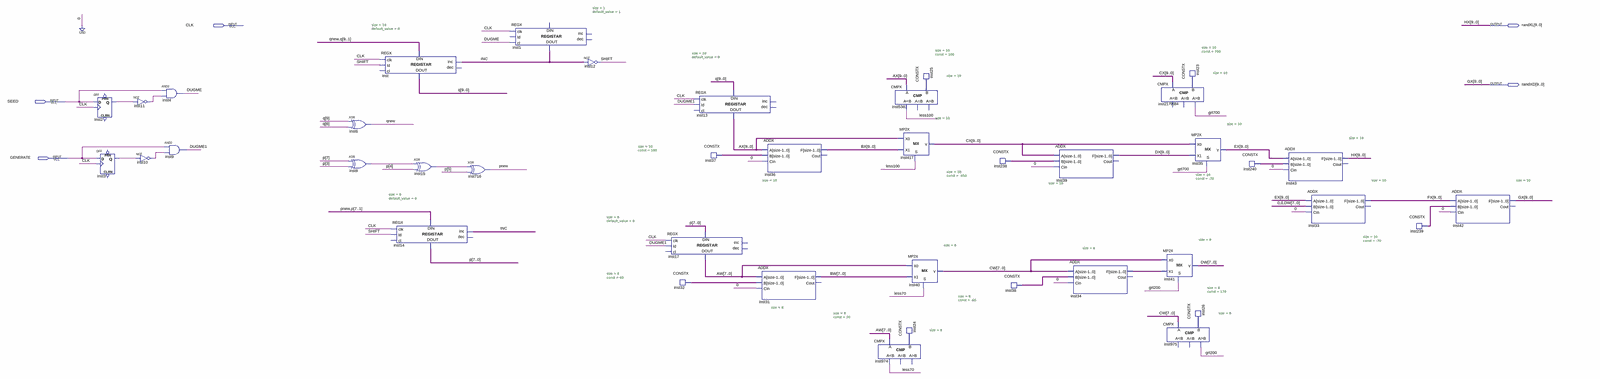
[diagram p0: schematic sheet, whole]
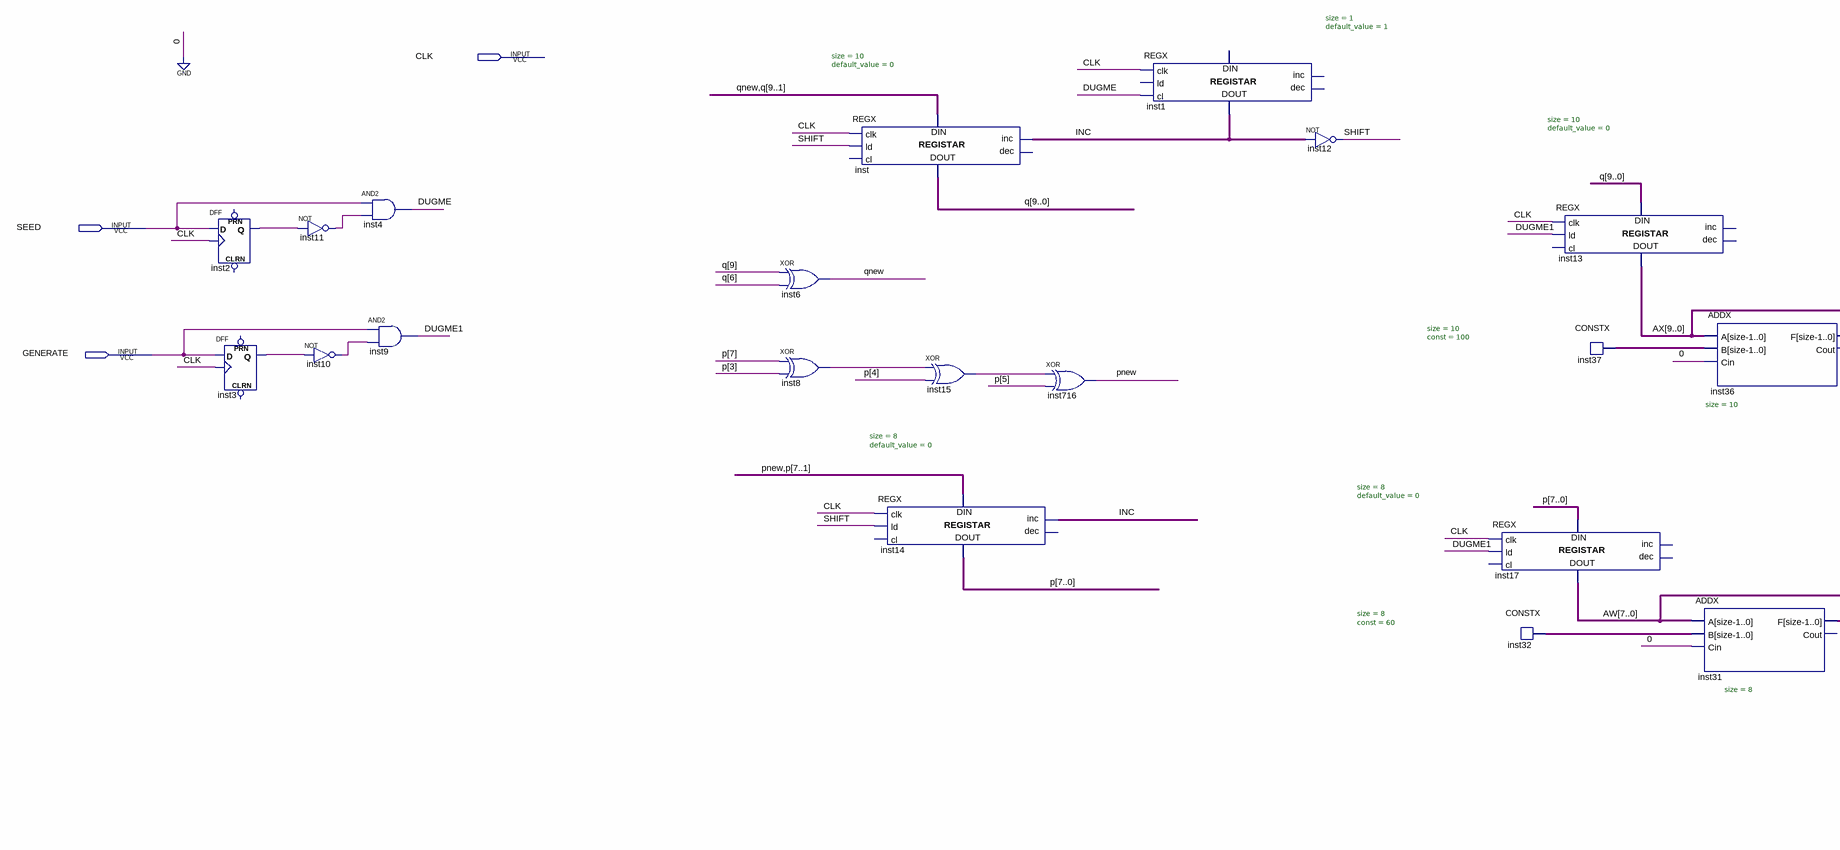
[diagram p1: schematic sheet, left part]
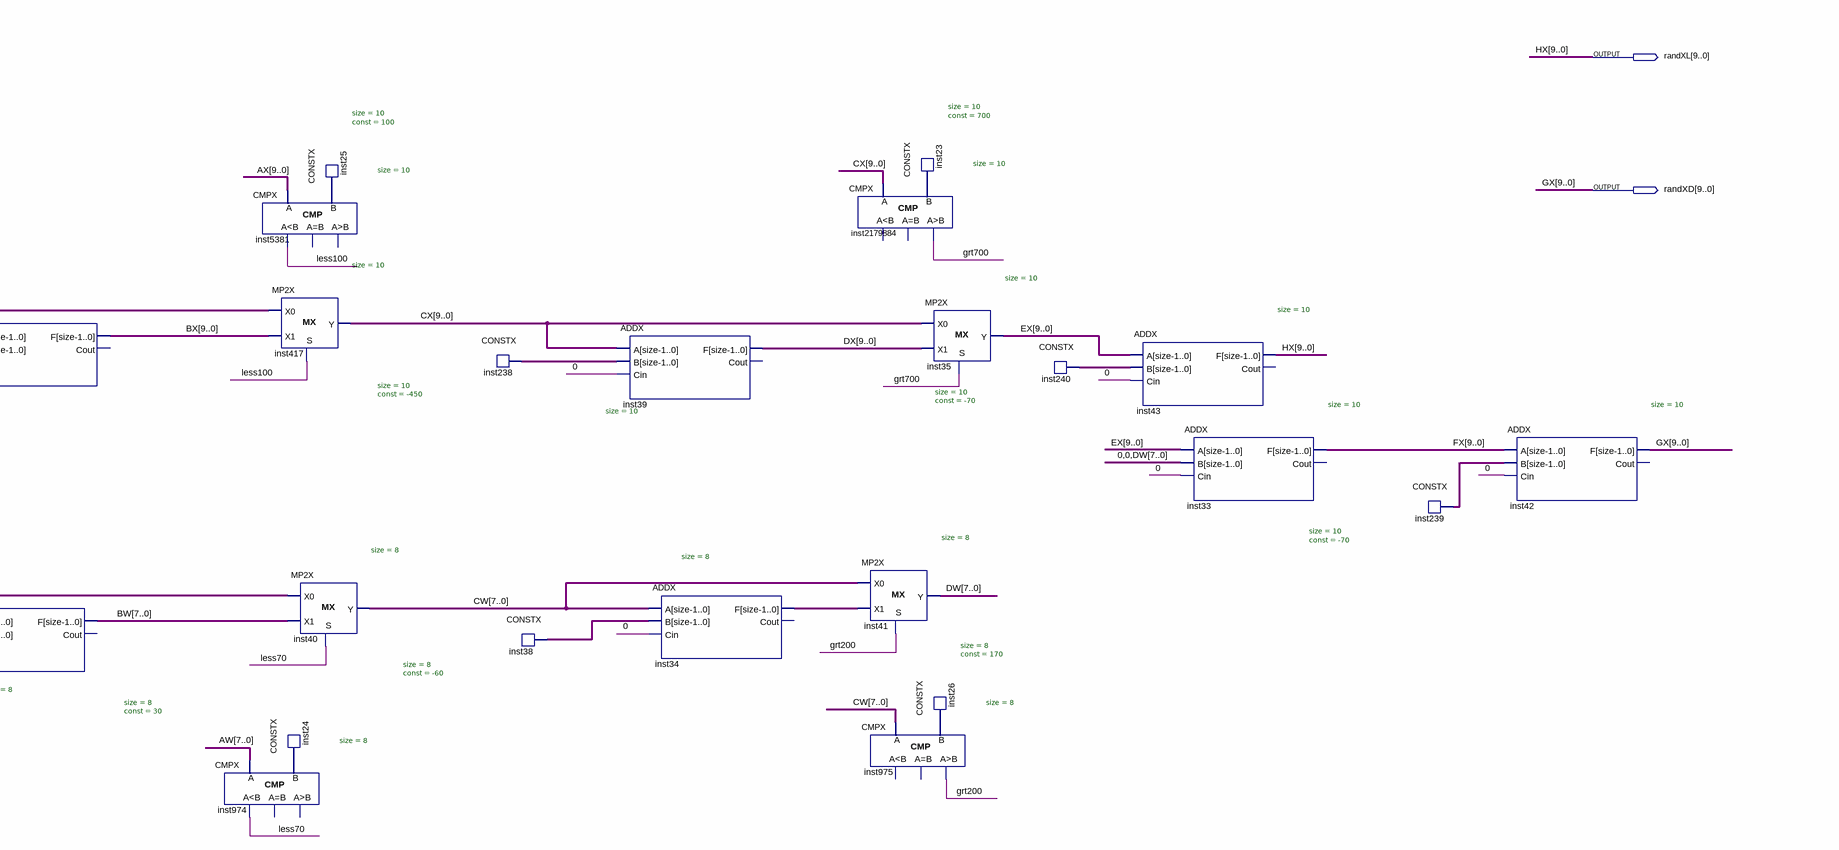
[diagram p2: schematic sheet, right part]
// Quartus schematic random.bdf as structural Verilog: 41 symbols, 5 pins
module random (
  input  CLK,
  input  SEED,
  input  GENERATE,
  output [9:0] randXL,
  output [9:0] randXD
);

  wire DUGME, DUGME1, grt200, grt700, INC, inst2_q, inst3_q, inst8_out, inst10_out, inst11_out, inst15_out,
       less70, less100, pnew, qnew, SHIFT;
  wire [7:0] AW, BW, CW, DW, inst24_data, inst26_data, inst32_data, inst34_f, inst38_data, p;
  wire [9:0] AX, BX, CX, DX, EX, FX, inst23_data, inst25_data, inst37_data, inst238_data, inst239_data,
       inst240_data, q;

  DFF inst2 (.CLK(CLK), .D(SEED), .Q(inst2_q));  // open: CLRN, PRN
  DFF inst3 (.CLK(CLK), .D(GENERATE), .Q(inst3_q));  // open: CLRN, PRN
  not inst11 (inst11_out, inst2_q);
  not inst10 (inst10_out, inst3_q);
  and inst4 (DUGME, SEED, inst11_out);
  and inst9 (DUGME1, GENERATE, inst10_out);
  xor inst6 (qnew, q[9], q[6]);
  xor inst8 (inst8_out, p[7], p[3]);
  REGX #(.size(10), .default_value(0)) inst (
    .clk(CLK), .ld(SHIFT), .inc(INC), .data_in({qnew, q[9:1]}), .data_out(q));  // open: cl, dec
  REGX #(.size(8), .default_value(0)) inst14 (
    .clk(CLK), .ld(SHIFT), .inc(INC), .data_in({pnew, p[7:1]}), .data_out(p));  // open: cl, dec
  xor inst15 (inst15_out, inst8_out, p[4]);
  xor inst716 (pnew, inst15_out, p[5]);
  REGX #(.size(1), .default_value(1)) inst1 (.clk(CLK), .cl(DUGME), .data_out(INC));  // open: ld, inc, dec, data_in
  not inst12 (SHIFT, INC);
  REGX #(.size(8), .default_value(0)) inst17 (
    .clk(CLK), .ld(DUGME1), .data_in(p), .data_out(AW));  // open: cl, inc, dec
  CONSTX #(.size(8), .\const (60)) inst32 (.data(inst32_data));
  REGX #(.size(10), .default_value(0)) inst13 (
    .clk(CLK), .ld(DUGME1), .data_in(q), .data_out(AX));  // open: cl, inc, dec
  CONSTX #(.size(10), .\const (100)) inst37 (.data(inst37_data));
  ADDX #(.size(8)) inst31 (.A(AW), .B(inst32_data), .Cin(1'b0), .F(BW));  // open: Cout
  ADDX #(.size(10)) inst36 (.A(AX), .B(inst37_data), .Cin(1'b0), .F(BX));  // open: Cout
  CMPX #(.size(8)) inst974 (.A(AW), .B(inst24_data), .ls(less70));  // open: eq, gr
  CMPX #(.size(10)) inst5381 (.A(AX), .B(inst25_data), .ls(less100));  // open: eq, gr
  CONSTX #(.size(10), .\const (100)) inst25 (.data(inst25_data));
  MP2X #(.size(10)) inst417 (.S(less100), .X0(AX), .X1(BX), .Y(CX));
  MP2X #(.size(8)) inst40 (.S(less70), .X0(AW), .X1(BW), .Y(CW));
  CONSTX #(.size(8), .\const (30)) inst24 (.data(inst24_data));
  CONSTX #(.size(10), .\const (-450)) inst238 (.data(inst238_data));
  CONSTX #(.size(8), .\const (-60)) inst38 (.data(inst38_data));
  ADDX #(.size(10)) inst39 (.A(CX), .B(inst238_data), .Cin(1'b0), .F(DX));  // open: Cout
  ADDX #(.size(8)) inst34 (.A(CW), .B(inst38_data), .Cin(1'b0), .F(inst34_f));  // open: Cout
  CMPX #(.size(10)) inst2179884 (.A(CX), .B(inst23_data), .gr(grt700));  // open: ls, eq
  MP2X #(.size(8)) inst41 (.S(grt200), .X0(CW), .X1(inst34_f), .Y(DW));
  CMPX #(.size(8)) inst975 (.A(CW), .B(inst26_data), .gr(grt200));  // open: ls, eq
  CONSTX #(.size(10), .\const (700)) inst23 (.data(inst23_data));
  MP2X #(.size(10)) inst35 (.S(grt700), .X0(CX), .X1(DX), .Y(EX));
  CONSTX #(.size(8), .\const (170)) inst26 (.data(inst26_data));
  CONSTX #(.size(10), .\const (-70)) inst240 (.data(inst240_data));
  ADDX #(.size(10)) inst43 (.A(EX), .B(inst240_data), .Cin(1'b0), .F(randXL));  // open: Cout
  ADDX #(.size(10)) inst33 (.A(EX), .B({2'b00, DW}), .Cin(1'b0), .F(FX));  // open: Cout
  CONSTX #(.size(10), .\const (-70)) inst239 (.data(inst239_data));
  ADDX #(.size(10)) inst42 (.A(FX), .B(inst239_data), .Cin(1'b0), .F(randXD));  // open: Cout

  // Other names for the same wires on the sheet: GX[9:0] = randXD; HX[9:0] = randXL
endmodule
